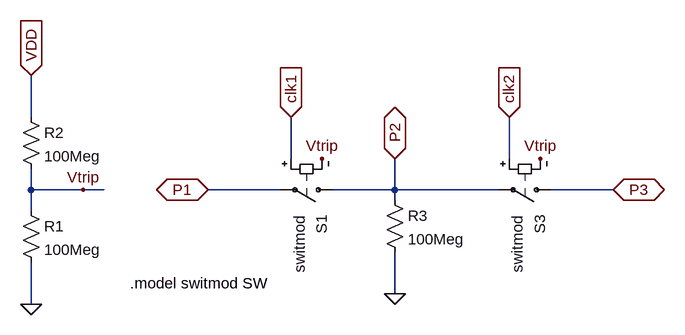
[diagram p0: schematic switches_2.asc]
switches_2.asc, the LTspice schematic file:
Version 4.1
SHEET 1 2740 696
WIRE 80 -848 80 -912
WIRE 480 -784 480 -848
WIRE 816 -784 816 -848
WIRE 80 -736 80 -768
WIRE 160 -736 80 -736
WIRE 192 -736 160 -736
WIRE 464 -736 352 -736
WIRE 640 -736 640 -784
WIRE 640 -736 544 -736
WIRE 800 -736 640 -736
WIRE 976 -736 880 -736
WIRE 640 -720 640 -736
WIRE 80 -704 80 -736
WIRE 640 -576 640 -640
WIRE 80 -560 80 -624
FLAG 160 -736 Vtrip
FLAG 80 -912 VDD
IOPIN 80 -912 In
FLAG 80 -560 0
FLAG 528 -784 Vtrip
FLAG 864 -784 Vtrip
FLAG 976 -736 P3
IOPIN 976 -736 BiDir
FLAG 352 -736 P1
IOPIN 352 -736 BiDir
FLAG 480 -848 clk1
IOPIN 480 -848 In
FLAG 816 -848 clk2
IOPIN 816 -848 In
FLAG 640 -784 P2
IOPIN 640 -784 BiDir
FLAG 640 -576 0
SYMBOL sw 560 -736 R90
WINDOW 3 24 -12 Left 0
WINDOW 38 39 67 Left 2
WINDOW 0 38 33 Left 2
SYMATTR Value ""
SYMATTR SpiceModel switmod
SYMATTR InstName S1
SYMBOL res 64 -720 R0
SYMATTR InstName R1
SYMATTR Value 100Meg
SYMBOL res 64 -864 R0
SYMATTR InstName R2
SYMATTR Value 100Meg
SYMBOL sw 896 -736 R90
WINDOW 3 24 -12 Left 0
WINDOW 38 39 67 Left 2
WINDOW 0 38 33 Left 2
SYMATTR Value ""
SYMATTR SpiceModel switmod
SYMATTR InstName S3
SYMBOL res 624 -736 R0
SYMATTR InstName R3
SYMATTR Value 100Meg
TEXT 232 -592 Left 2 !.model switmod SW

The netlist it stands for:
* switches_2.asc
S1 P2 P1 clk1 Vtrip switmod
R1 Vtrip 0 100Meg
R2 VDD Vtrip 100Meg
S3 P3 P2 clk2 Vtrip switmod
R3 P2 0 100Meg
.model switmod SW
.backanno
.end